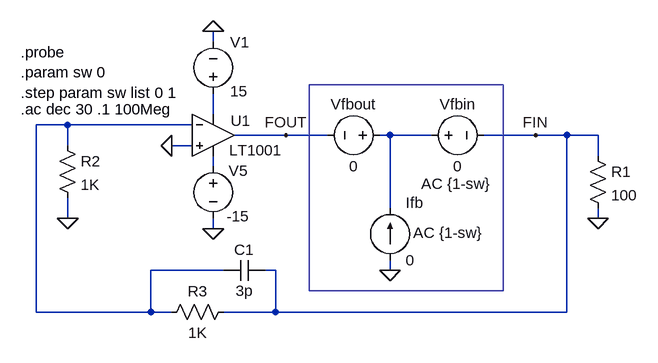
[diagram p0: schematic brewster.asc]
brewster.asc, the LTspice schematic file:
Version 4
SHEET 1 2168 1300
WIRE 144 -32 144 -48
WIRE 144 80 144 48
WIRE -80 96 -128 96
WIRE 112 96 -80 96
WIRE 256 112 176 112
WIRE 320 112 256 112
WIRE 416 112 400 112
WIRE 480 112 416 112
WIRE 640 112 560 112
WIRE 688 112 640 112
WIRE 736 112 688 112
WIRE -80 128 -80 96
WIRE 112 128 80 128
WIRE 736 144 736 112
WIRE 144 160 144 144
WIRE 416 224 416 112
WIRE -80 240 -80 208
WIRE 736 240 736 224
WIRE 144 256 144 240
WIRE 160 320 48 320
WIRE 240 320 224 320
WIRE 416 320 416 304
WIRE -128 384 -128 96
WIRE 48 384 48 320
WIRE 48 384 -128 384
WIRE 80 384 48 384
WIRE 240 384 240 320
WIRE 240 384 160 384
WIRE 688 384 688 112
WIRE 688 384 240 384
FLAG 416 320 0
FLAG 144 -48 0
FLAG 80 128 0
FLAG -80 240 0
FLAG 736 240 0
FLAG 144 256 0
FLAG 640 112 FIN
FLAG 256 112 FOUT
SYMBOL voltage 144 64 M180
WINDOW 123 0 0 Left 2
WINDOW 39 0 0 Left 2
WINDOW 0 26 95 Left 2
WINDOW 3 26 20 Left 2
SYMATTR InstName V1
SYMATTR Value 15
SYMBOL current 416 304 M180
WINDOW 38 39 48 Left 2
WINDOW 0 24 88 Left 2
WINDOW 3 24 0 Left 2
WINDOW 123 36 42 Left 2
WINDOW 39 0 0 Left 2
SYMATTR InstName Ifb
SYMATTR Value 0
SYMATTR Value2 AC {1-sw}
SYMBOL voltage 464 112 R270
WINDOW 0 32 56 VTop 2
WINDOW 3 -32 56 VBottom 2
WINDOW 123 -59 54 VBottom 2
WINDOW 39 -32 56 VBottom 2
SYMATTR InstName Vfbin
SYMATTR Value 0
SYMATTR Value2 AC {1-sw}
SYMBOL voltage 416 112 R90
WINDOW 0 -32 56 VBottom 2
WINDOW 3 32 56 VTop 2
WINDOW 123 32 56 VTop 2
WINDOW 39 32 56 VTop 2
SYMATTR InstName Vfbout
SYMATTR Value 0
SYMBOL res 720 128 R0
SYMATTR InstName R1
SYMATTR Value 100
SYMBOL res -96 112 R0
SYMATTR InstName R2
SYMATTR Value 1K
SYMBOL res 176 368 R90
WINDOW 0 0 56 VBottom 2
WINDOW 3 32 56 VTop 2
SYMATTR InstName R3
SYMATTR Value 1K
SYMBOL cap 224 304 R90
WINDOW 0 0 32 VBottom 2
WINDOW 3 32 32 VTop 2
SYMATTR InstName C1
SYMATTR Value 3p
SYMBOL Opamps\\LT1001 144 48 R0
WINDOW 0 27 42 Left 2
WINDOW 3 25 87 Left 2
SYMATTR InstName U1
SYMBOL voltage 144 144 R0
WINDOW 123 0 0 Left 2
WINDOW 39 0 0 Left 2
WINDOW 0 24 23 Left 2
WINDOW 3 21 93 Left 2
SYMATTR InstName V5
SYMATTR Value -15
TEXT -152 72 Left 2 !.ac dec 30 .1 100Meg
TEXT -152 -16 Left 2 !.probe\n.param sw 0\n.step param sw list 0 1
LINE Normal 292 34 292 351
LINE Normal 590 34 292 34
LINE Normal 590 351 292 351
LINE Normal 590 34 590 351

The netlist it stands for:
* brewster.asc
V1 N001 0 15
Ifb 0 N003 0 AC {1-sw}
Vfbin N003 FIN 0 AC {1-sw}
Vfbout N003 FOUT 0
R1 FIN 0 100
R2 N002 0 1K
R3 FIN N002 1K
C1 FIN N002 3p
XU1 0 N002 N001 N004 FOUT LT1001  ; pins In+ In- V+ V- OUT
V5 N004 0 -15
.ac dec 30 .1 100Meg
.probe
.param sw 0
.step param sw list 0 1
.lib LTC.lib
.backanno
.end